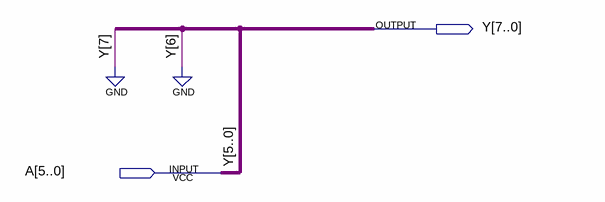
[diagram p0: schematic sheet]
// Quartus schematic extend5_7.bdf as structural Verilog: 0 symbols, 2 pins
module extend5_7 (
  input  [5:0] A,
  output [7:0] Y
);


  assign Y = {2'b00, A};
endmodule
